# Altium schematic sheet Main_Scheme.SchDoc
size A4
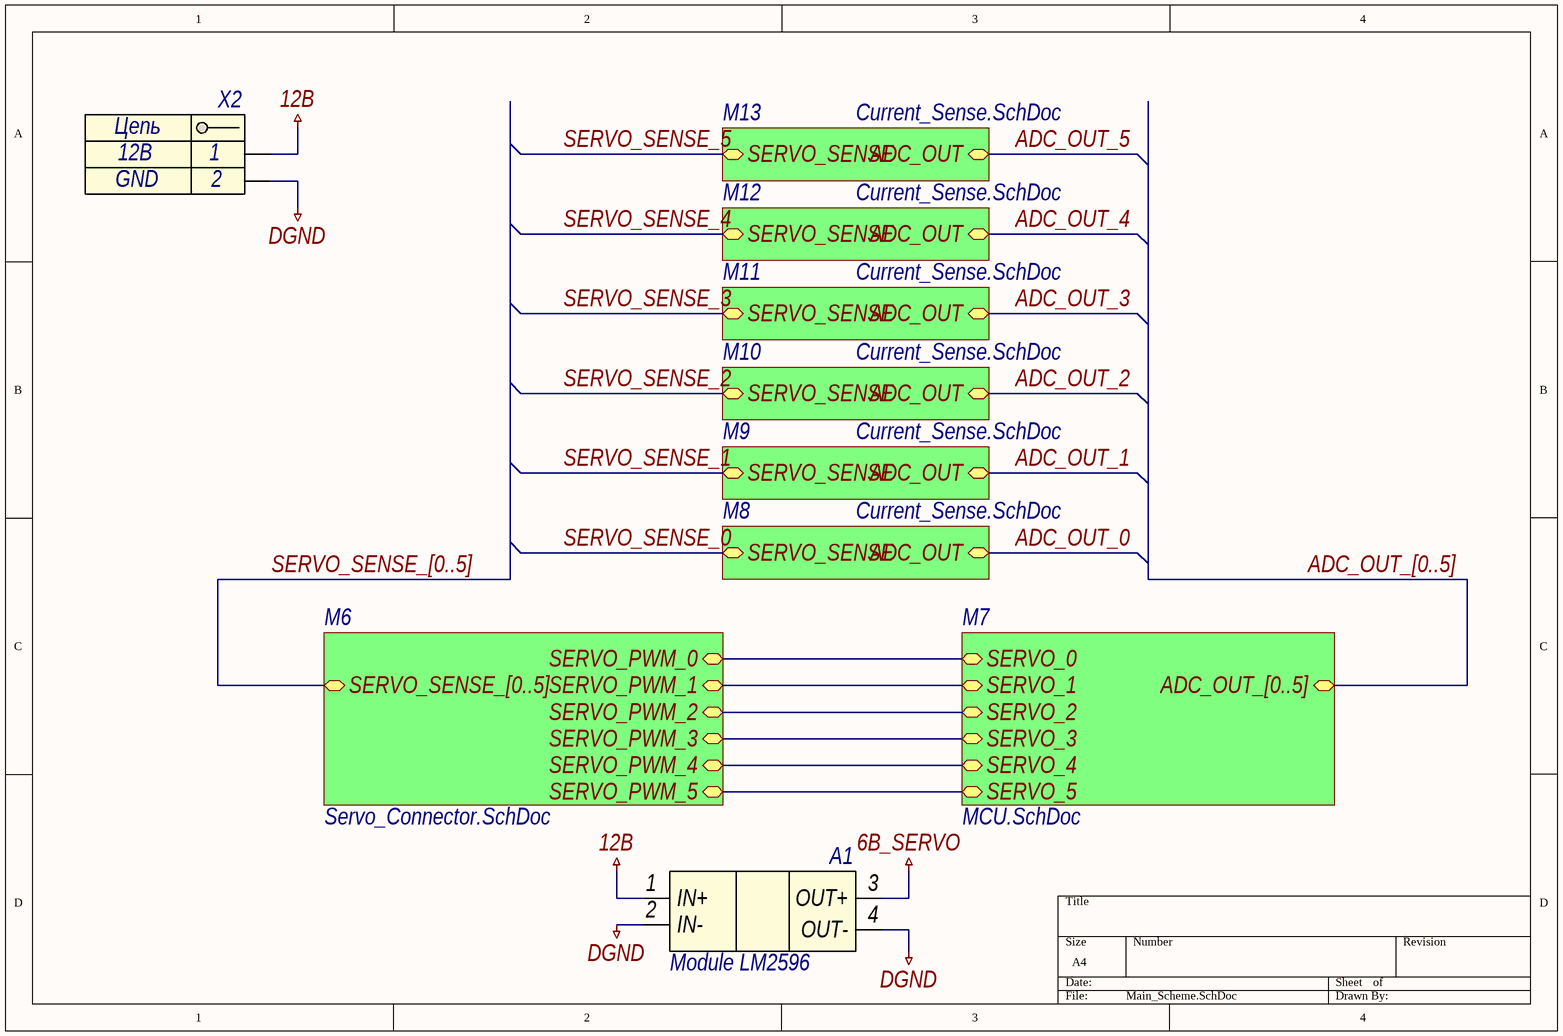
[diagram p0: Main_Scheme.SchDoc]

## Parts
A1  Module LM2596  [module LM2596]
X2  Header_2_trm  [TERMINAL-2WAY-3.5MM]  (value not drawn)

## Sub-sheets
M6 = Servo_Connector.SchDoc: SERVO_PWM_3, SERVO_PWM_2, SERVO_PWM_4, SERVO_PWM_5, SERVO_PWM_0, SERVO_PWM_1, SERVO_SENSE_[0..5]
M7 = MCU.SchDoc: SERVO_0, SERVO_5, SERVO_4, SERVO_3, SERVO_2, SERVO_1, ADC_OUT_[0..5]
M8 = Current_Sense.SchDoc: ADC_OUT, SERVO_SENSE
M9 = Current_Sense.SchDoc: ADC_OUT, SERVO_SENSE
M10 = Current_Sense.SchDoc: ADC_OUT, SERVO_SENSE
M11 = Current_Sense.SchDoc: ADC_OUT, SERVO_SENSE
M12 = Current_Sense.SchDoc: ADC_OUT, SERVO_SENSE
M13 = Current_Sense.SchDoc: ADC_OUT, SERVO_SENSE

## Nets
6В_SERVO: A1.3(OUT+)
12В: A1.1(IN+) X2.1
DGND: A1.2(IN-) A1.4(OUT-) X2.2
ADC_OUT_0: sheet M8/ADC_OUT
ADC_OUT_1: sheet M9/ADC_OUT
ADC_OUT_2: sheet M10/ADC_OUT
ADC_OUT_3: sheet M11/ADC_OUT
ADC_OUT_4: sheet M12/ADC_OUT
ADC_OUT_5: sheet M13/ADC_OUT
SERVO_SENSE_0: sheet M8/SERVO_SENSE
SERVO_SENSE_1: sheet M9/SERVO_SENSE
SERVO_SENSE_2: sheet M10/SERVO_SENSE
SERVO_SENSE_3: sheet M11/SERVO_SENSE
SERVO_SENSE_4: sheet M12/SERVO_SENSE
SERVO_SENSE_5: sheet M13/SERVO_SENSE
(unnamed): sheet M6/SERVO_PWM_3, sheet M7/SERVO_3
(unnamed): sheet M6/SERVO_PWM_2, sheet M7/SERVO_2
(unnamed): sheet M6/SERVO_PWM_4, sheet M7/SERVO_4
(unnamed): sheet M6/SERVO_PWM_5, sheet M7/SERVO_5
(unnamed): sheet M6/SERVO_PWM_0, sheet M7/SERVO_0
(unnamed): sheet M6/SERVO_PWM_1, sheet M7/SERVO_1

## Buses and harness runs
bus ADC_OUT_[0..5] = sheet M7/ADC_OUT_[0..5]
bus SERVO_SENSE_[0..5] = sheet M6/SERVO_SENSE_[0..5]

## Notes on the sheet
- (in symbol connect34) Цепь

## Library data of the parts
A1 = module0: Low-Dropout Regulator for 5-V to 3.3-V Conversion; id: module0; Part Name: LM2596
X2 = connect34: Разъем - 2 конт. клеммник; Part Name: TERMINAL BLOCK 2 way; Contact_1: 12В; Contact_2: GND; Etch: 3.5mm; id: connect34